# Altium schematic sheet JAjchel_schemat.SchDoc
size A4
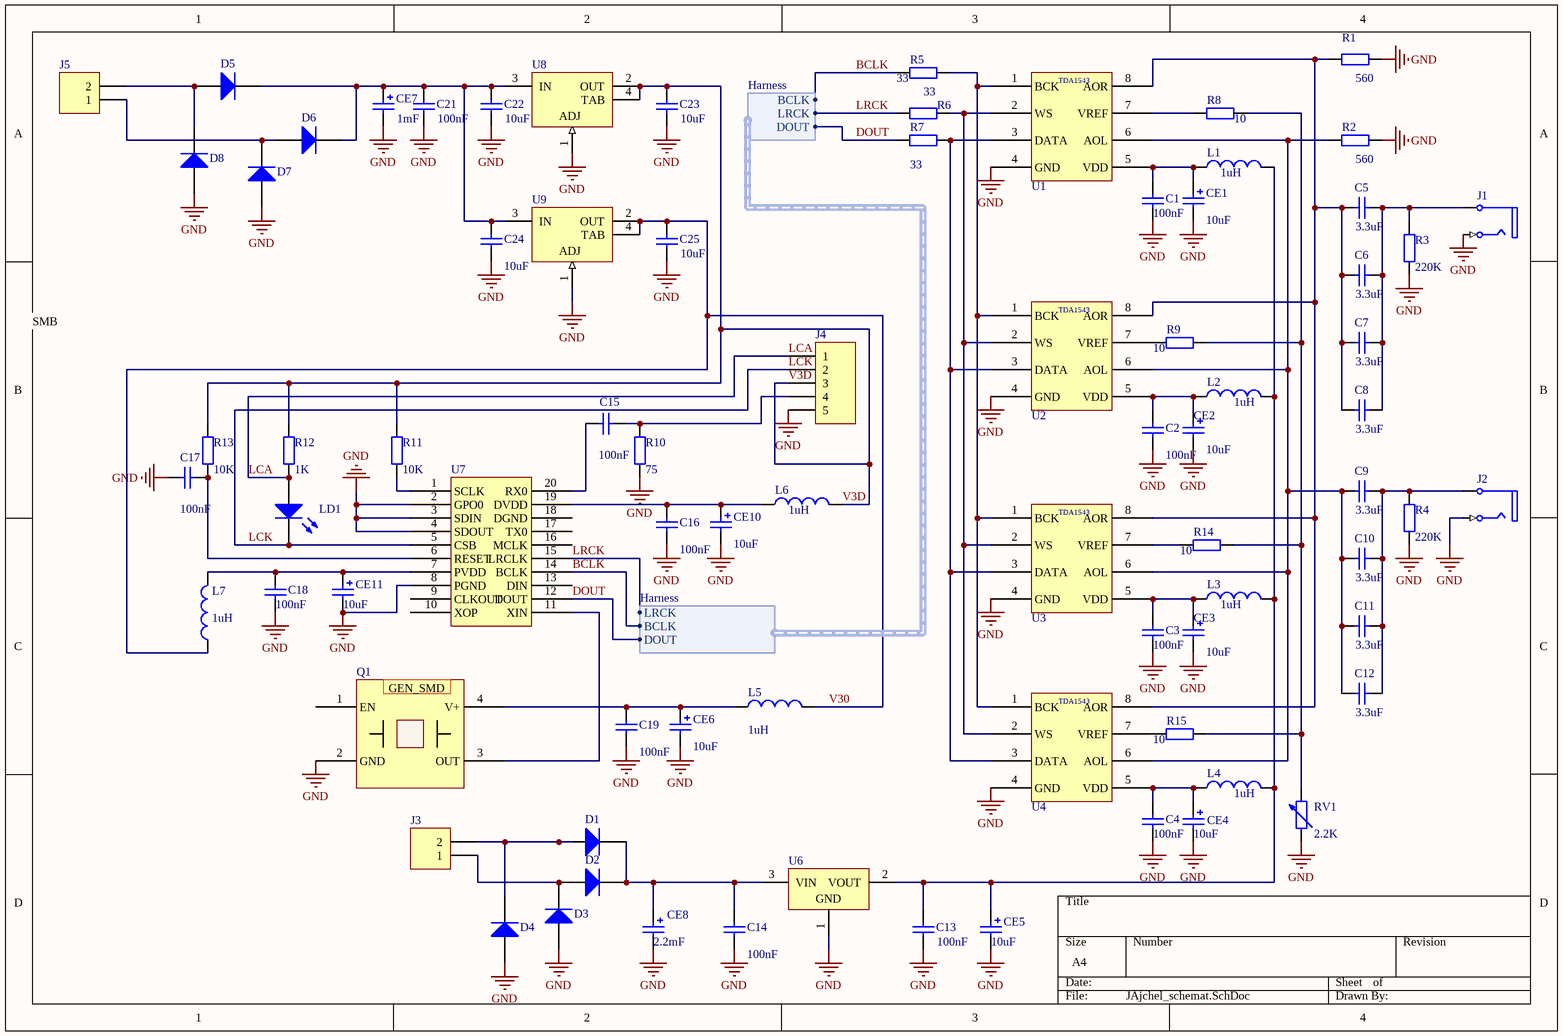
[diagram p0: JAjchel_schemat.SchDoc]

## Parts
C1  value 100nF  [C1206]  (hidden comment: Comment)
C2  value 100nF  [C1206]  (hidden comment: Comment)
C3  value 100nF  [C1206]  (hidden comment: Comment)
C4  value 100nF  [C1206]  (hidden comment: Comment)
C5  value 3.3uF  [RAD-0.3]  (hidden comment: Comment)
C6  value 3.3uF  [RAD-0.3]  (hidden comment: Comment)
C7  value 3.3uF  [RAD-0.3]  (hidden comment: Comment)
C8  value 3.3uF  [RAD-0.3]  (hidden comment: Comment)
C9  value 3.3uF  [RAD-0.3]  (hidden comment: Comment)
C10  value 3.3uF  [RAD-0.3]  (hidden comment: Comment)
C11  value 3.3uF  [RAD-0.3]  (hidden comment: Comment)
C12  value 3.3uF  [RAD-0.3]  (hidden comment: Comment)
C13  value 100nF  [C1206]  (hidden comment: Comment)
C14  value 100nF  [C1206]  (hidden comment: Comment)
C15  value 100nF  [C1206]  (hidden comment: Comment)
C16  value 100nF  [C1206]  (hidden comment: Comment)
C17  value 100nF  [C1206]  (hidden comment: Comment)
C18  value 100nF  [C1206]  (hidden comment: Comment)
C19  value 100nF  [C1206]  (hidden comment: Comment)
C21  value 100nF  [C1206]  (hidden comment: Comment)
C22  value 10uF  [C1206]  (hidden comment: Comment)
C23  value 10uF  [C1206]  (hidden comment: Comment)
C24  value 10uF  [C1206]  (hidden comment: Comment)
C25  value 10uF  [C1206]  (hidden comment: Comment)
CE1  value 10uF  [C1206]  (hidden comment: Comment)
CE2  value 10uF  [C1206]  (hidden comment: Comment)
CE3  value 10uF  [C1206]  (hidden comment: Comment)
CE4  value 10uF  [C1206]  (hidden comment: Comment)
CE5  value 10uF  [C1206]  (hidden comment: Comment)
CE6  value 10uF  [C1206]  (hidden comment: Comment)
CE7  value 1mF  [POLAR0.8]  (hidden comment: Comment)
CE8  value 2.2mF  [POLAR0.8]  (hidden comment: Comment)
CE10  value 10uF  [C1206]  (hidden comment: Comment)
CE11  value 10uF  [C1206]  (hidden comment: Comment)
D1  Comment  (value not drawn)
D2  Comment  (value not drawn)
D3  Comment  (value not drawn)
D4  Comment  (value not drawn)
D5  Comment  (value not drawn)
D6  Comment  (value not drawn)
D7  Comment  (value not drawn)
D8  Comment  (value not drawn)
J1  Comment  [RCA/4.5-H2]  (value not drawn)
J2  Comment  [RCA/4.5-H2]  (value not drawn)
J3  Comment  [HDR1X2]  (value not drawn)
J4  Comment  [HDR1X5]  (value not drawn)
J5  Comment  [HDR1X2]  (value not drawn)
L1  value 1uH  [0402-A]  (hidden comment: Comment)
L2  value 1uH  [0402-A]  (hidden comment: Comment)
L3  value 1uH  [0402-A]  (hidden comment: Comment)
L4  value 1uH  [0402-A]  (hidden comment: Comment)
L5  value 1uH  [0402-A]  (hidden comment: Comment)
L6  value 1uH  [0402-A]  (hidden comment: Comment)
L7  value 1uH  [0402-A]  (hidden comment: Comment)
LD1  Comment  [LED-1]  (value not drawn)
Q1  Comment  (value not drawn)
R1  value 560  [J1-0603]  (hidden comment: Comment)
R2  value 560  [J1-0603]  (hidden comment: Comment)
R3  value 220K  [J1-0603]  (hidden comment: Comment)
R4  value 220K  [J1-0603]  (hidden comment: Comment)
R5  value 33  [J1-0603]  (hidden comment: Comment)
R6  value 33  [J1-0603]  (hidden comment: Comment)
R7  value 33  [J1-0603]  (hidden comment: Comment)
R8  value 10  [J1-0603]  (hidden comment: Comment)
R9  value 10  [J1-0603]  (hidden comment: Comment)
R10  value 75  [J1-0603]  (hidden comment: Comment)
R11  value 10K  [J1-0603]  (hidden comment: Comment)
R12  value 1K  [J1-0603]  (hidden comment: Comment)
R13  value 10K  [J1-0603]  (hidden comment: Comment)
R14  value 10  [J1-0603]  (hidden comment: Comment)
R15  value 10  [J1-0603]  (hidden comment: Comment)
RV1  value 2.2K  [AXIAL-0.6]  (hidden comment: Comment)
U1  Comment  (value not drawn)
U2  Comment  (value not drawn)
U3  Comment  (value not drawn)
U4  Comment  (value not drawn)
U6  Comment  (value not drawn)
U7  Comment  (value not drawn)
U8  Comment  (value not drawn)
U9  Comment  (value not drawn)

## Harnesses
Harness: LRCK, BCLK, DOUT
Harness: BCLK, LRCK, DOUT

## Nets
GND: C1.1 C2.1 C3.1 C4.1 C13.1 C14.1 C16.1 C17.1 C18.1 C19.1 C21.1 C22.1 C23.1 C24.1 C25.1 CE1.2 CE2.2 CE3.2 CE4.2 CE5.2 CE6.2 CE7.2 CE8.2 CE10.2 CE11.2 D3.1(A) D4.1(A) D7.1(A) D8.1(A) J1.2B(Signal) J2.2B(Signal) J4.5 Q1.2(GND) R1.2 R2.2 R3.1 R4.1 R10.1 RV1.1 U1.4(GND) U2.4(GND) U3.4(GND) U4.4(GND) U6.1(GND) U7.2(GPO0) U7.3(SDIN) U7.4(SDOUT) U7.8(PGND) U8.1(ADJ) U9.1(ADJ)
BCLK: R5.1 U7.14(BCLK) ; harness Harness.BCLK
DOUT: R7.1 U7.12(DOUT) ; harness Harness.DOUT
LCA: J4.1 LD1.1(A) R12.1
LCK: J4.2 LD1.2(K) U7.5(CSB)
LRCK: R6.1 U7.15(LRCLK) ; harness Harness.LRCK
V3D: C23.2 J4.3 L6.2 R11.2 R12.2 R13.2 U8.2(OUT) U8.4(TAB)
V30: C25.2 L5.2 L7.1 U9.2(OUT) U9.4(TAB)
NetC1_2: C1.2 CE1.1 L1.1 U1.5(VDD)
NetC2_2: C2.2 CE2.1 L2.1 U2.5(VDD)
NetC3_2: C3.2 CE3.1 L3.1 U3.5(VDD)
NetC4_2: C4.2 CE4.1 L4.1 U4.5(VDD)
NetC5_1: C5.1 C6.1 C7.1 C8.1 R1.1 U1.8(AOR) U2.8(AOR) U3.8(AOR) U4.8(AOR)
NetC5_2: C5.2 C6.2 C7.2 C8.2 J1.1A(Ground) R3.2
NetC9_1: C9.1 C10.1 C11.1 C12.1 R2.1 U1.6(AOL) U2.6(AOL) U3.6(AOL) U4.6(AOL)
NetC9_2: C9.2 C10.2 C11.2 C12.2 J2.1A(Ground) R4.2
NetC13_2: C13.2 CE5.1 L1.2 L2.2 L3.2 L4.2 U6.2(VOUT)
NetC14_2: C14.2 CE8.1 D1.2(K) D2.2(K) U6.3(VIN)
NetC15_1: C15.1 U7.20(RX0)
NetC15_2: C15.2 J4.4 R10.2
NetC16_2: C16.2 CE10.1 L6.1 U7.19(DVDD)
NetC17_2: C17.2 R13.1 U7.6(RESET)
NetC18_2: C18.2 CE11.1 L7.2 U7.7(PVDD)
NetC19_2: C19.2 CE6.1 L5.1 Q1.4(V+)
NetC21_2: C21.2 C22.2 C24.2 CE7.1 D5.2(K) D6.2(K) U8.3(IN) U9.3(IN)
NetD1_1: D1.1(A) D4.2(K) J3.2
NetD2_1: D2.1(A) D3.2(K) J3.1
NetD5_1: D5.1(A) D8.2(K) J5.2
NetD6_1: D6.1(A) D7.2(K) J5.1
NetQ1_3: Q1.3(OUT) U7.11(XIN)
NetR5_2: R5.2 U1.1(BCK) U2.1(BCK) U3.1(BCK) U4.1(BCK)
NetR6_2: R6.2 U1.2(WS) U2.2(WS) U3.2(WS) U4.2(WS)
NetR7_2: R7.2 U1.3(DATA) U2.3(DATA) U3.3(DATA) U4.3(DATA)
NetR8_1: R8.1 U1.7(VREF)
NetR8_2: R8.2 R9.2 R14.2 R15.2 RV1.2
NetR9_1: R9.1 U2.7(VREF)
NetR11_1: R11.1 U7.1(SCLK)
NetR14_1: R14.1 U3.7(VREF)
NetR15_1: R15.1 U4.7(VREF)

Not connected (* = marked no-connect by the designer): Q1 1(EN); U7 9(CLKOUT) 10(XOP) 13(DIN) 16(MCLK) 17(TX0) 18(DGND)

## Notes on the sheet
- SMB
- (in symbol Oscilator12mhz) GEN_SMD; Text

## Library data of the parts
C1-C19 C21-C25 = Cap: Capacitor; Published: 8-Jun-2000; LatestRevisionDate: 17-Jul-2002; LatestRevisionNote: Re-released for DXP Platform.; PackageReference: RAD-0.3; Publisher: Altium Limited; PackageDescription: Radial Cap, Thru-Hole; 2 Leads; 0.3 in Pin Spacing
CE1-CE8 CE10 CE11 = Cap Pol2: Polarized Capacitor (Axial); Published: 8-Jun-2000; LatestRevisionDate: 17-Jul-2002; LatestRevisionNote: Re-released for DXP Platform.; PackageReference: POLAR0.8; Publisher: Altium Limited; PackageDescription: Polarized Capacitor; 2 Leads
D1-D8 = D-AK-2
J1 J2 = RCA: RCA Phono Jack, Right Angle, Thru-Hole, Snap-In; PCB_Layout: Complies with manufacturer's recommendation.; DrillAndSlotSize: Corresponds to nominal value.; Published: 15-Jul-2004; LatestRevisionDate: 15-Jul-2004; LatestRevisionNote: Component Replaced.; DatasheetDocument: 7-Jul-2000; PackageDocument: 7-Jul-2000; PackageReference: 161; Publisher: Altium Limited; ComponentLink1Description: Manufacturer Link; ComponentLink1URL: http://www.mouser.com/kobiconn/
J3 J5 = Header 2: Header, 2-Pin; LatestRevisionDate: 17-Jul-2002; LatestRevisionNote: Re-released for DXP Platform.; Publisher: Altium Limited
J4 = Header 5: Header, 5-Pin; LatestRevisionDate: 17-Jul-2002; LatestRevisionNote: Re-released for DXP Platform.; Publisher: Altium Limited
L1-L7 = Inductor: Code_IEC: 1005; Published: 8-Jun-2000; LatestRevisionDate: 29-May-2009; LatestRevisionNote: IPC-7351 Footprint Added.; PackageReference: 0402-A; Publisher: Altium Limited; PackageDescription: Chip Inductor; Code_JEITA: 0402
LD1 = LED1: Typical RED GaAs LED; Published: 8-Jun-2000; LatestRevisionDate: 08-Jul-2005; LatestRevisionNote: Mech Layer 1 removed.; PackageReference: LED-1; Publisher: Altium Limited; PackageDescription: LED; 2 Leads
Q1 = Oscilator12mhz: Oscilator 12MHz; Supplier 1: Farnell; HelpURL: https://www.tme.eu/pl/Document/96c4d9b8a8fd6040d2a0173ba011486f/cfps-39.pdf; Supplier Part Number 1: 1276649RL
R1-R15 = Res2: Resistor; Published: 8-Jun-2000; LatestRevisionDate: 17-Jul-2002; LatestRevisionNote: Re-released for DXP Platform.; PackageReference: AXIAL-0.4; Publisher: Altium Limited; PackageDescription: Axial Device, Thru-Hole; 2 Leads; 0.4 in Pin Spacing
RV1 = Res Adj2: Variable Resistor; Set Position: 0.5; Published: 8-Jun-2000; LatestRevisionDate: 17-Jul-2002; LatestRevisionNote: Re-released for DXP Platform.; PackageReference: AXIAL-0.6; Publisher: Altium Limited; PackageDescription: Axial Device, Thru-Hole; 2 Leads; 0.6 in Pin Spacing
U1-U4 = TDA1543
U6 = LT-LT1086-T-3
U7 = WM8804
U8 U9 = PM-REG-LM1086ADJ-SOT4